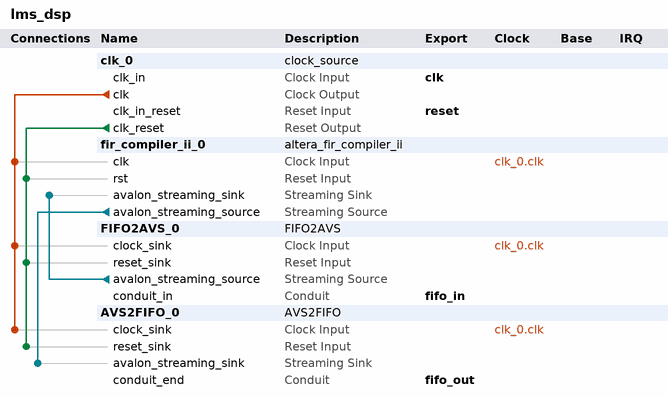
[diagram p0: system contents]
# Platform Designer (Qsys) system lms_dsp, MAX 10 10M16SAU169C8G
# Parameters at their usual value, and those the tool derives, are not listed.
package require -exact qsys 18.1
create_system lms_dsp
set_project_property DEVICE_FAMILY {MAX 10}
set_project_property DEVICE 10M16SAU169C8G

add_instance clk_0 clock_source 18.1
set_instance_parameter_value clk_0 clockFrequency 125000000

add_instance fir_compiler_ii_0 altera_fir_compiler_ii 18.1
set_instance_parameter_value fir_compiler_ii_0 coeffBitWidth 8
set_instance_parameter_value fir_compiler_ii_0 coeffFracBitWidth 8
set_instance_parameter_value fir_compiler_ii_0 coeffReload false
set_instance_parameter_value fir_compiler_ii_0 coeffScaling none
set_instance_parameter_value fir_compiler_ii_0 coeffType frac
set_instance_parameter_value fir_compiler_ii_0 inputBitWidth 12
set_instance_parameter_value fir_compiler_ii_0 inputChannelNum 2
set_instance_parameter_value fir_compiler_ii_0 inputFracBitWidth 11
set_instance_parameter_value fir_compiler_ii_0 inputRate 125
set_instance_parameter_value fir_compiler_ii_0 inputType frac
set_instance_parameter_value fir_compiler_ii_0 outLsbBitRem 9
set_instance_parameter_value fir_compiler_ii_0 outMsbBitRem 6
set_instance_parameter_value fir_compiler_ii_0 outType frac
set_instance_parameter_value fir_compiler_ii_0 readWriteMode read_write
set_instance_parameter_value fir_compiler_ii_0 speedGrade fast

add_instance FIFO2AVS_0 FIFO2AVS 1.0
set_instance_parameter_value FIFO2AVS_0 datawidth 48

add_instance AVS2FIFO_0 AVS2FIFO 1.0
set_instance_parameter_value AVS2FIFO_0 datawidth 48

# connections
add_connection clk_0.clk AVS2FIFO_0.clock_sink clock
add_connection clk_0.clk FIFO2AVS_0.clock_sink clock
add_connection clk_0.clk fir_compiler_ii_0.clk clock
add_connection clk_0.clk_reset AVS2FIFO_0.reset_sink reset
add_connection clk_0.clk_reset FIFO2AVS_0.reset_sink reset
add_connection clk_0.clk_reset fir_compiler_ii_0.rst reset
add_connection FIFO2AVS_0.avalon_streaming_source fir_compiler_ii_0.avalon_streaming_sink avalon_streaming
add_connection fir_compiler_ii_0.avalon_streaming_source AVS2FIFO_0.avalon_streaming_sink avalon_streaming

# exported interfaces
add_interface clk clock sink
set_interface_property clk EXPORT_OF clk_0.clk_in
add_interface fifo_in conduit end
set_interface_property fifo_in EXPORT_OF FIFO2AVS_0.conduit_in
add_interface fifo_out conduit end
set_interface_property fifo_out EXPORT_OF AVS2FIFO_0.conduit_end
add_interface reset reset sink
set_interface_property reset EXPORT_OF clk_0.clk_in_reset

set_interconnect_requirement {$system} qsys_mm.clockCrossingAdapter HANDSHAKE
set_interconnect_requirement {$system} qsys_mm.enableEccProtection FALSE
set_interconnect_requirement {$system} qsys_mm.insertDefaultSlave FALSE
set_interconnect_requirement {$system} qsys_mm.maxAdditionalLatency 1

save_system lms_dsp.qsys
